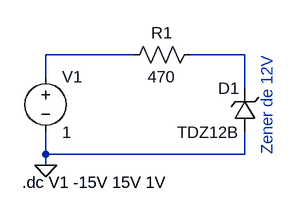
[diagram p0: schematic E2-barridoDC-zener12V.asc]
E2-barridoDC-zener12V.asc, the LTspice schematic file:
Version 4
SHEET 1 880 680
WIRE -304 80 -432 80
WIRE -144 80 -224 80
WIRE -432 112 -432 80
WIRE -144 128 -144 80
WIRE -432 224 -432 192
WIRE -144 224 -144 192
WIRE -144 224 -432 224
WIRE -432 240 -432 224
FLAG -432 240 0
SYMBOL voltage -432 96 R0
WINDOW 123 0 0 Left 0
WINDOW 39 0 0 Left 0
SYMATTR InstName V1
SYMATTR Value 1
SYMBOL zener -128 192 R180
WINDOW 0 24 64 Left 2
WINDOW 3 24 0 Left 2
SYMATTR InstName D1
SYMATTR Value TDZ12B
SYMATTR Description Diode
SYMATTR Type diode
SYMBOL res -208 64 R90
WINDOW 0 0 56 VBottom 2
WINDOW 3 32 56 VTop 2
SYMATTR InstName R1
SYMATTR Value 470
TEXT -466 264 Left 2 !.dc V1 -15V 15V 1V
TEXT -112 224 VLeft 2 ;Zener de 12V

The netlist it stands for:
* E2-barridoDC-zener12V.asc
V1 N001 0 1
D1 0 N002 TDZ12B
R1 N002 N001 470
.model D D
.lib standard.dio
.dc V1 -15V 15V 1V
* Zener de 12V
.backanno
.end